# Altium schematic sheet ZigBee.SchDoc
size A3
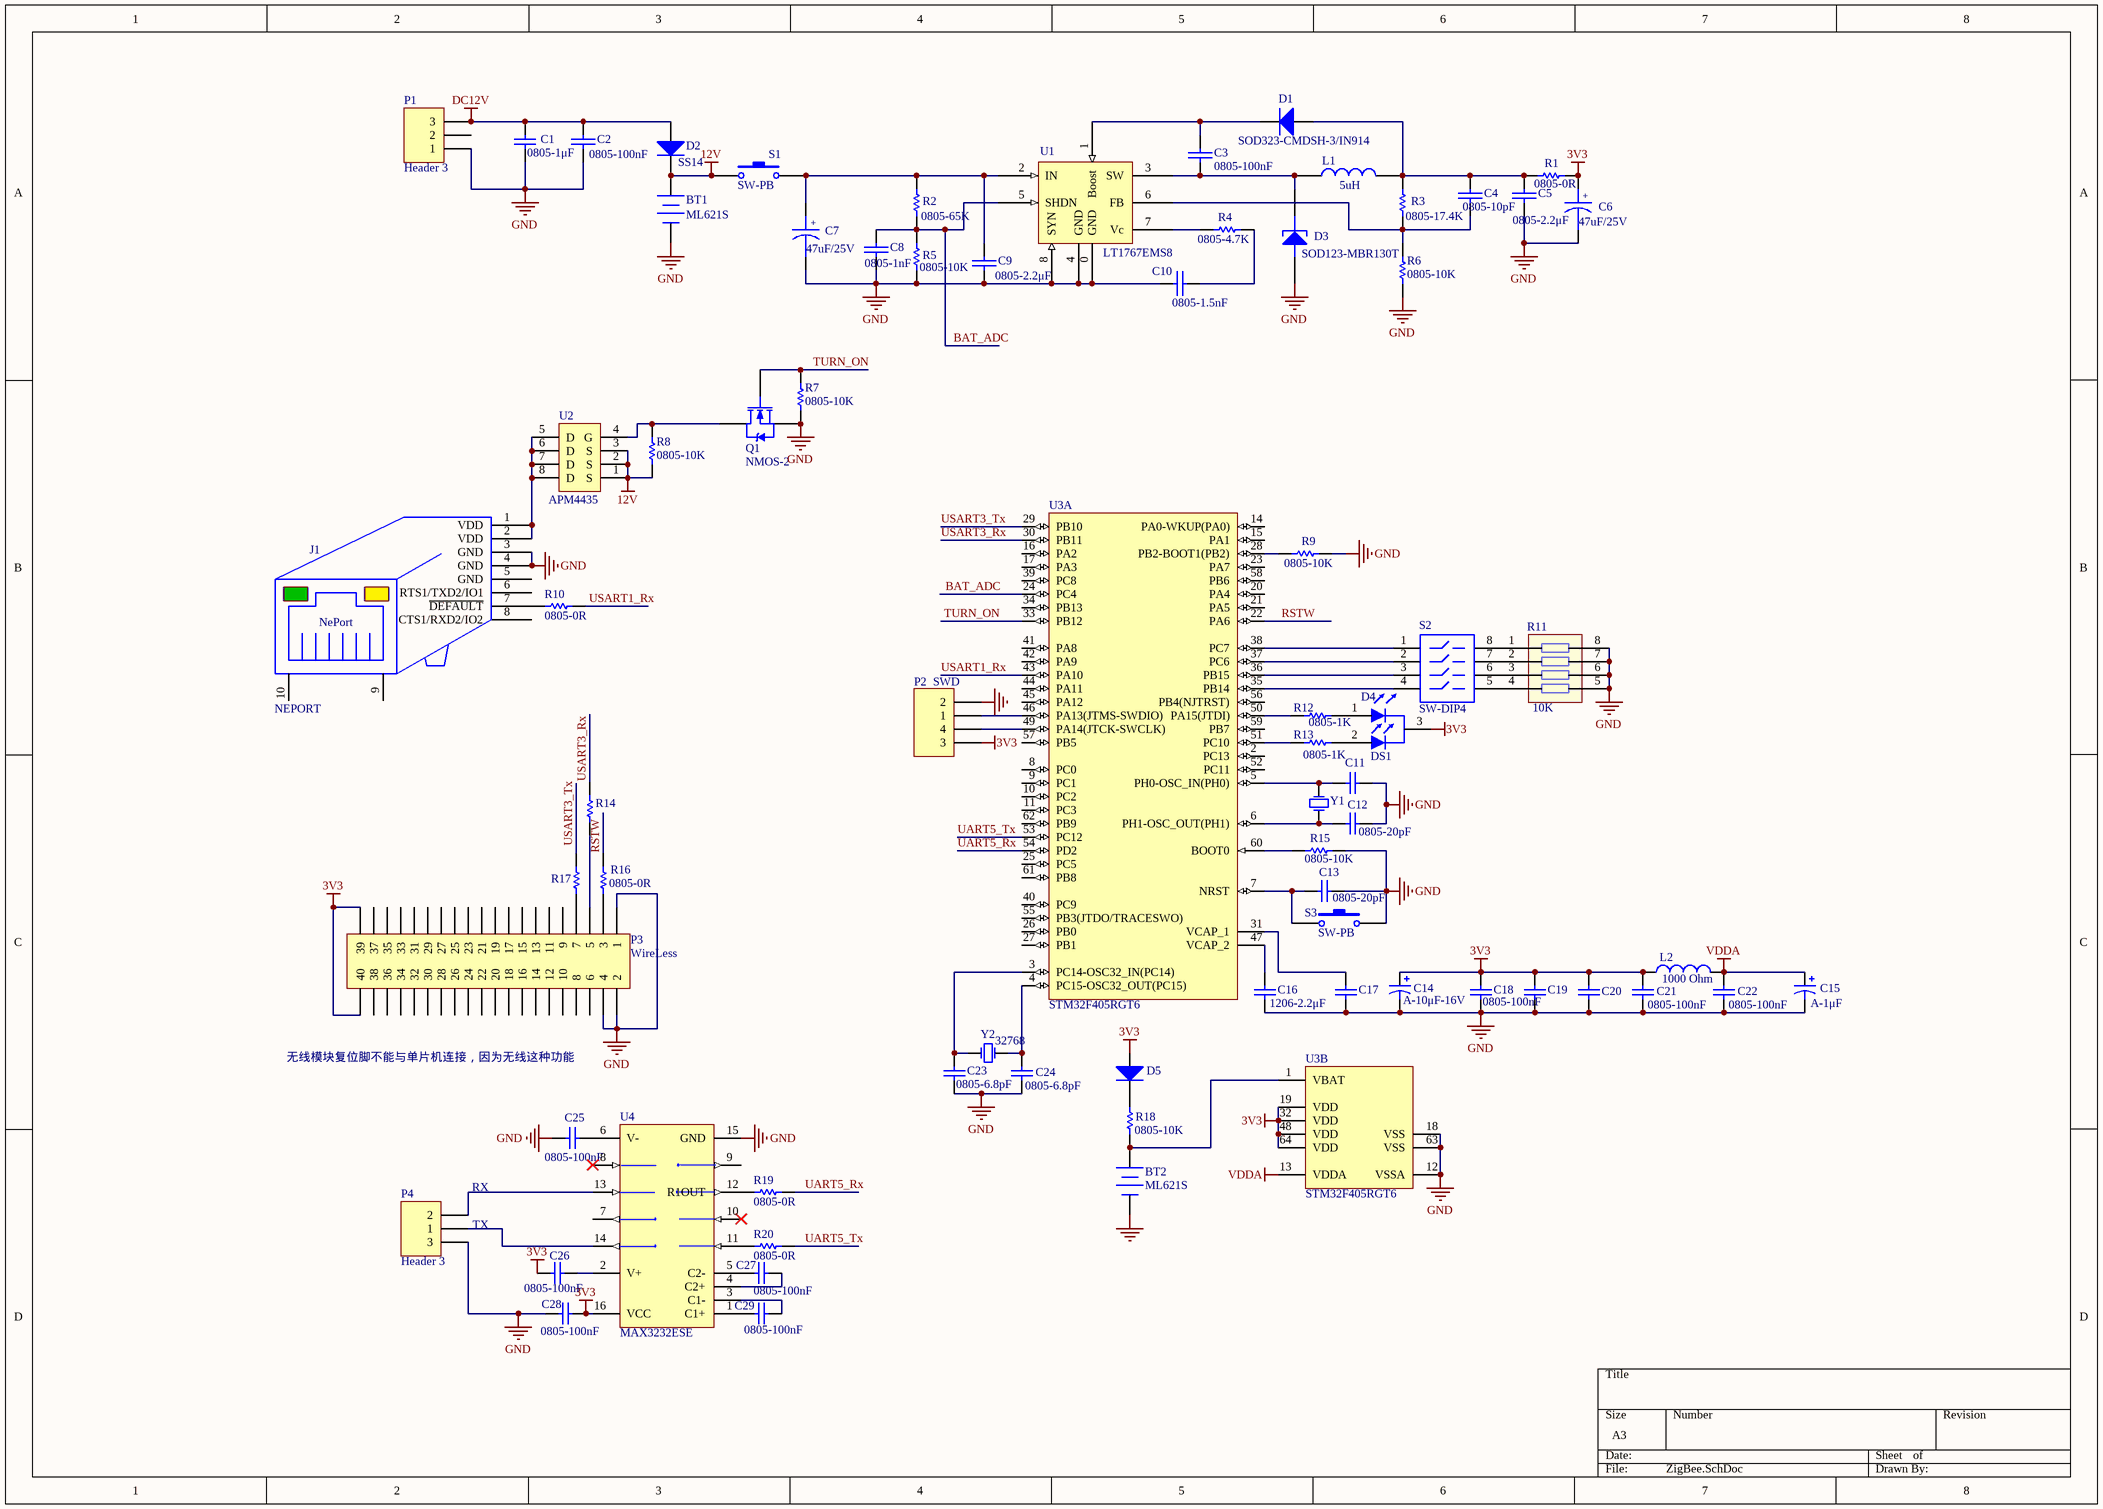
[diagram p0: ZigBee.SchDoc]

## Parts
BT1  ML621S  [VH-3.96-2]
BT2  ML621S  [ML621]
C1  0805-1μF  [0805C]
C2  0805-100nF  [0805C]
C3  0805-100nF  [0805C]
C4  0805-10pF  [0805C]
C5  0805-2.2μF  [0805C]
C6  47uF/25V  [SMD-47uF/25V]
C7  47uF/25V  [SMD-47uF/25V]
C8  0805-1nF  [0805C]
C9  0805-2.2μF  [0805C]
C10  0805-1.5nF  [0805C]
C11  0805-20pF  [0805C]  (value not drawn)
C12  0805-20pF  [0805C]
C13  0805-20pF  [0805C]
C14  A-10μF-16V  [TANA]
C15  A-1μF  [TANA]
C16  1206-2.2μF  [1206C]
C17  1206-2.2μF  [1206C]  (value not drawn)
C18  0805-100nF  [0805C]
C19  0805-100nF  [0805C]  (value not drawn)
C20  0805-100nF  [0805C]  (value not drawn)
C21  0805-100nF  [0805C]
C22  0805-100nF  [0805C]
C23  0805-6.8pF  [0805C]
C24  0805-6.8pF  [0805C]
C25  0805-100nF  [0805C]
C26  0805-100nF  [0805C]
C27  0805-100nF  [0805C]
C28  0805-100nF  [0805C]
C29  0805-100nF  [0805C]
D1  SOD323-CMDSH-3/IN914  [SOD-323]
D2  SS14  [DO-214AC]
D3  SOD123-MBR130T  [SOD123/X.85]
D4  DS1  [5MM/F5]
D5  1N4148  [SOD-80/MLL34]  (value not drawn)
J1  NEPORT  [RJ45_8P8C]
L1  5uH  [SMD]
L2  1000 Ohm  [INDC4516AM]
P1  Header 3  [XH-2.54-3]
P2  SWD  [HDR1X4]
P3  WireLess  [SMALL/MIDDLE OEM MODEM]
P4  Header 3  [XH-2.54-3]
Q1  NMOS-2  [TO-220AB]
R1  0805-0R  [0805]
R2  0805-65K  [0805]
R3  0805-17.4K  [0805]
R4  0805-4.7K  [0805]
R5  0805-10K  [0805]
R6  0805-10K  [0805]
R7  0805-10K  [0805]
R8  0805-10K  [0805]
R9  0805-10K  [0805]
R10  0805-0R  [0805]
R11  10K  [8P4R-0603]
R12  0805-1K  [0805]
R13  0805-1K  [0805]
R14  0805-0R  [0805]  (value not drawn)
R15  0805-10K  [0805]
R16  0805-0R  [0805]
R17  0805-0R  [0805]  (value not drawn)
R18  0805-10K  [0805]
R19  0805-0R  [0805]
R20  0805-0R  [0805]
S1  SW-PB  [XH-2.54-2]
S2  SW-DIP4  [DIP-8]
S3  SW-PB  [SW3*4*2MM]
U1  LT1767EMS8  [MS8_N]
U2  APM4435  [SOP-8M]
U3  STM32F405RGT6  [TQFP64_M]  (parts A,B of 2)
U4  MAX3232ESE  [NSO16_N]
Y1  8MHz  [XTAL]  (value not drawn)
Y2  32768  [1206CY]

## Nets
3V3: C6.1 C14.1 C18.2 C19.2 C20.2 C21.2 C26.2 C28.1 D4.3 D5.1(A) L2.1 P2.3 P3.39 P3.40 R1.2 U3.19(VDD) U3.32(VDD) U3.48(VDD) U3.64(VDD) U4.16(VCC)
12V: BT1.2(+) D2.2(K) R8.1 S1.2 U2.1(S) U2.2(S) U2.3(S)
DC12V: C1.1 C2.1 D2.1(A) P1.3
GND: BT1.1(-) BT2.1(-) C1.2 C2.2 C5.2 C6.2 C7.2 C8.2 C9.2 C10.1 C11.1 C12.1 C13.1 C14.2 C15.2 C16.1 C17.1 C18.1 C19.1 C20.1 C21.1 C22.1 C23.2 C24.2 C25.2 C28.2 D3.1(A) J1.3(GND) J1.4(GND) P1.1 P2.2 P3.1 P3.2 P3.4 P4.3 Q1.3(D) R5.1 R6.1 R7.1 R9.2 R11.5 R11.6 R11.7 R11.8 R15.2 S3.2 U1.0(GND) U1.4(GND) U1.8(SYN) U3.12(VSSA) U3.18(VSS) U3.63(VSS) U4.15(GND)
VDDA: C15.1 C22.2 L2.2 U3.13(VDDA)
BAT_ADC: C8.1 R2.1 R5.2 U1.5(SHDN) U3.24(PC4)
RSTW: R16.1 U3.22(PA6)
TURN_ON: Q1.1(G) R7.2 U3.33(PB12)
UART5_Rx: R19.2 U3.54(PD2)
UART5_Tx: R20.2 U3.53(PC12)
USART1_Rx: R10.1 U3.43(PA10)
USART3_Rx: R14.1 U3.30(PB11)
USART3_Tx: R17.1 U3.29(PB10)
NetBT2_2: BT2.2(+) R18.2 U3.1(VBAT)
NetC3_1: C3.1 D1.2(K) U1.1(Boost)
NetC3_2: C3.2 D3.2(K) L1.1 U1.3(SW)
NetC4_1: C4.1 C5.1 D1.1(A) L1.2 R1.1 R3.2
NetC4_2: C4.2 R3.1 R6.2 U1.6(FB)
NetC7_1: C7.1 C9.1 R2.2 S1.1 U1.2(IN)
NetC10_2: C10.2 R4.1
NetC11_2: C11.2 U3.5(PH0-OSC_IN(PH0)) Y1.2(OSC2)
NetC12_2: C12.2 U3.6(PH1-OSC_OUT(PH1)) Y1.1(OSC1)
NetC13_2: C13.2 S3.1 U3.7(NRST)
NetC16_2: C16.2 U3.47(VCAP_2)
NetC17_2: C17.2 U3.31(VCAP_1)
NetC23_1: C23.1 U3.3(PC14-OSC32_IN(PC14)) Y2.2(OSC2)
NetC24_1: C24.1 U3.4(PC15-OSC32_OUT(PC15)) Y2.1(OSC1)
NetC25_1: C25.1 U4.6(V-)
NetC26_1: C26.1 U4.2(V+)
NetC27_1: C27.1 U4.4(C2+)
NetC27_2: C27.2 U4.5(C2-)
NetC29_1: C29.1 U4.3(C1-)
NetC29_2: C29.2 U4.1(C1+)
NetD4_1: D4.1 R12.2
NetD4_2: D4.2 R13.2
NetD5_2: D5.2(K) R18.1
NetJ1_1: J1.1(VDD) J1.2(VDD) U2.5(D) U2.6(D) U2.7(D) U2.8(D)
NetJ1_7: J1.7(~{DEFAULT}) R10.2
NetP2_1: P2.1 U3.46(PA13(JTMS-SWDIO))
NetP2_4: P2.4 U3.49(PA14(JTCK-SWCLK))
NetP3_3: P3.3 R16.2
NetP3_5: P3.5 R14.2
NetP3_7: P3.7 R17.2
NetP4_1: P4.1 U4.14(T1OUT)
NetP4_2: P4.2 U4.13(R1IN)
NetQ1_2: Q1.2(S) R8.2 U2.4(G)
NetR4_2: R4.2 U1.7(Vc)
NetR9_1: R9.1 U3.28(PB2-BOOT1(PB2))
NetR11_1: R11.1 S2.8
NetR11_2: R11.2 S2.7
NetR11_3: R11.3 S2.6
NetR11_4: R11.4 S2.5
NetR12_1: R12.1 U3.50(PA15(JTDI))
NetR13_1: R13.1 U3.51(PC10)
NetR15_1: R15.1 U3.60(BOOT0)
NetR19_1: R19.1 U4.12(R1OUT)
NetR20_1: R20.1 U4.11(T1IN)
NetS2_1: S2.1 U3.38(PC7)
NetS2_2: S2.2 U3.37(PC6)
NetS2_3: S2.3 U3.36(PB15)
NetS2_4: S2.4 U3.35(PB14)

Not connected (* = marked no-connect by the designer): J1 5(GND) 6(RTS1/TXD2/IO1) 8(CTS1/RXD2/IO2) 9(SHELL) 10(SHELL); P1 2; P3 6 8 9 10 11 12 13 14 15 16 17 18 19 20 21 22 23 24 25 26 27 28 29 30 31 32 33 34 35 36 37 38; U3 2(PC13) 8(PC0) 9(PC1) 10(PC2) 11(PC3) 14(PA0-WKUP(PA0)) 15(PA1) 16(PA2) 17(PA3) 20(PA4) 21(PA5) 23(PA7) 25(PC5) 26(PB0) 27(PB1) 34(PB13) 39(PC8) 40(PC9) 41(PA8) 42(PA9) 44(PA11) 45(PA12) 52(PC11) 55(PB3(JTDO/TRACESWO)) 56(PB4(NJTRST)) 57(PB5) 58(PB6) 59(PB7) 61(PB8) 62(PB9); U4 7(T2OUT) 8(R2IN)* 9(R2OUT) 10(T2IN)*

## Notes on the sheet
- 无线模块复位脚不能与单片机连接，因为无线这种功能
- (near P4) RX
- (near P4) TX
- (in symbol NEPORT) NePort
- (in symbol 电解电容) +

## Library data of the parts
BT1 BT2 = Battery: Multicell Battery; Published: 24-Mar-1999; LatestRevisionDate: 17-Jul-2002; LatestRevisionNote: Re-released for DXP Platform.; PackageReference: BAT-2; Publisher: Altium Limited
C1 C11-C13 C16-C29 = Cap: Capacitor; Published: 8-Jun-2000; LatestRevisionDate: 17-Jul-2002; LatestRevisionNote: Re-released for DXP Platform.; PackageReference: RAD-0.3; Publisher: Altium Limited; PackageDescription: Radial Cap, Thru-Hole; 2 Leads; 0.3 in Pin Spacing
  C1: Value: 0805-1μF
  C11-C13: Value: 0805-20pF
  C16 C17: Value: 1206-2.2μF
  C18-C22 C25-C29: Value: 0805-100nF
  C23 C24: Value: 0805-6.8pF
C2-C5 C8-C10 = 普通电容: Capacitor
C6 C7 = 电解电容: Capacitor
C14 = Cap Pol1: Polarized Capacitor (Radial); Published: 8-Jun-2000; LatestRevisionDate: 17-Jul-2002; LatestRevisionNote: Re-released for DXP Platform.; PackageReference: RB7.6-15; Publisher: Altium Limited; PackageDescription: Polarized Capacitor (Radial); 2 Leads; Value: A-10μF-16V
C15 = Cap Pol1: Polarized Capacitor (Radial); Value: 1μF; Published: 8-Jun-2000; LatestRevisionDate: 17-Jul-2002; LatestRevisionNote: Re-released for DXP Platform.; PackageReference: RB7.6-15; Publisher: Altium Limited; PackageDescription: Polarized Capacitor (Radial); 2 Leads
D1 D2 = DIODE
D3 = TUNNEL: Tunnel FDiode
D5 = Diode 1N4148: High Conductance Fast Diode; Published: 8-Jun-2000; LatestRevisionDate: 17-Jul-2002; LatestRevisionNote: Re-released for DXP Platform.; DatasheetVersion: 1997; PackageReference: DO-35; Publisher: Altium Limited; PackageDescription: Diode, Axial; Body 3.8 x 1.9 mm (LxDia. max), Lead Dia. 0.53 mm (max); Code_JEDEC: DO-204-AH; ComponentLink1Description: Manufacturer Link; ComponentLink1URL: http://www.fairchildsemi.com/; ComponentLink2Description: Datasheet; ComponentLink2URL: http://www.fairchildsemi.com/ds/1N%2F1N4148.pdf
J1 = NEPORT: serial to ethernet RJ45 jack
L1 = INDUCTOR
L2 = Inductor: BLM41PG102SN1L\CBW451616U900; Code_IEC: 1005; Published: 8-Jun-2000; LatestRevisionDate: 29-May-2009; LatestRevisionNote: IPC-7351 Footprint Added.; PackageReference: 0402-A; Publisher: Altium Limited; PackageDescription: Chip Inductor; Code_JEITA: 0402; Value: 1000 Ohm
P1 P4 = Header 3: Header, 3-Pin; LatestRevisionDate: 17-Jul-2002; LatestRevisionNote: Re-released for DXP Platform.; Publisher: Altium Limited
P2 = Header 4: Header, 4-Pin; LatestRevisionDate: 17-Jul-2002; LatestRevisionNote: Re-released for DXP Platform.; Publisher: Altium Limited
P3 = Header 20X2: Header, 20-Pin, Dual row; LatestRevisionDate: 17-Jul-2002; LatestRevisionNote: Re-released for DXP Platform.; Publisher: Altium Limited
Q1 = NMOS-2: N-Channel Power MOSFET; Note: Pin 2 is electrically connected to pin 4.; Published: 8-Jun-2000; LatestRevisionDate: 17-Jul-2002; LatestRevisionNote: Re-released for DXP Platform.; DatasheetDocument: PD-9.814; PackageReference: TO-220AB; Publisher: Altium Limited; Code_JEDEC: TO-220-AB; ComponentLink1Description: Manufacturer Link; ComponentLink1URL: http://www.irf.com/
R1-R9 R15 R18 = Res1: Resistor; Published: 8-Jun-2000; LatestRevisionDate: 17-Jul-2002; LatestRevisionNote: Re-released for DXP Platform.; PackageReference: AXIAL-0.3; Publisher: Altium Limited; PackageDescription: Axial Device, Thru-Hole; 2 Leads; 0.3 in Pin Spacing
  R1: Value: 0805-0R
  R2: Value: 0805-65K
  R3: Value: 0805-17.4K
  R4: Value: 0805-4.7K
  R5-R9 R15 R18: Value: 0805-10K
R10 R14 R16 R17 R19 R20 = Res1: Resistor; Rule: PcbType=ProtelPcb; Published: 8-Jun-2000; LatestRevisionDate: 17-Jul-2002; LatestRevisionNote: Re-released for DXP Platform.; PackageReference: AXIAL-0.3; Publisher: Altium Limited; PackageDescription: Axial Device, Thru-Hole; 2 Leads; 0.3 in Pin Spacing; Value: 0805-0R
R11 = RN4
R12 R13 = Res Semi: Semiconductor Resistor; Published: 8-Jun-2000; LatestRevisionDate: 17-Jul-2002; LatestRevisionNote: Re-released for DXP Platform.; PackageReference: AXIAL-0.5; Publisher: Altium Limited; Value: 0805-1K
S1 S3 = SW-PB: Switch; Published: 24-Mar-1999; LatestRevisionDate: 17-Jul-2002; LatestRevisionNote: Re-released for DXP Platform.; PackageReference: SPST-2; Publisher: Altium Limited
S2 = SW-DIP4: DIP Switch; Published: 24-Mar-1999; LatestRevisionDate: 17-Jul-2002; LatestRevisionNote: Re-released for DXP Platform.; PackageReference: DIP-8; Publisher: Altium Limited
U3 = STM32F405RGT6: ARM Cortex-M4 32-bit MCU+FPU, 210 DMIPS, 1024 kB Flash, 192 kB Internal RAM, 51 I/Os, 64-pin LQFP, -40 to 85 degC, Tray; Manufacturer: STMicroelectronics; D/A Converter: 2x12-bit; FLASH Size (Prog) (kB): 1024; I/Os (High Current): 51; Internal RAM Size (kB): 192; Operating Frequency(F) (Processor speed) (MHz): 168; Supply Voltage(Vcc) max (V): 3.6; Supply Voltage(Vcc) min (V): 1.8; DatasheetVersion: Rev. 4; PackageVersion: Rev. 4, 06/2013; PackageReference: LQFP64; PackageDescription: 64-Pin Low Profile Quad Flat Package, 10 x 10 mm Body, 0.5 mm Pitch; Supplier 1: Digi-Key; Supplier Part Number 1: 497-11767-ND; Supplier 2: Farnell; Supplier Part Number 2: 2064363; Supplier 3: Newark; Supplier Part Number 3: 73T2329; Supplier 4: Mouser; Supplier Part Number 4: 511-STM32F405RGT6; Core: ARM Cortex-M4; Packing: Tray; Mounting Technology: Surface Mount; PartNumber: STM32F405RGT6; ComponentLink1Description: Manufacturer URL; ComponentLink1URL: http://www.st.com/web/en/home.html; ComponentLink2Description: Datasheet; ComponentLink2URL: http://www.st.com/st-web-ui/static/active/en/resource/technical/document/datasheet/DM00037051.pdf; ComponentLink3Description: Package Specification; ComponentLink3URL: http://www.st.com/st-web-ui/static/active/en/resource/technical/document/datasheet/DM00037051.pdf
U4 = MAX3232ESE: 3.0V TO 5.5V, Low-Power, up to 1Mbps, True RS-232 Transceiver Using Four 0.1µF External Capacitor; Published: 16-Jan-2001; LatestRevisionDate: 13-Apr-2006; LatestRevisionNote: IPC-7351 Footprint Added.; DatasheetVersion: Mar-1999; PackageReference: NSO16; Publisher: Altium Limited; PackageDescription: 16-Pin Small Outline Integrated Circuit 1.27 mm Pitch; Code_JEDEC: MS-012-AC; Code_IPC: SOIC127P600-16; ComponentLink1Description: Manufacturer Link; ComponentLink1URL: http://www.maxim-ic.com/; ComponentLink2Description: Datasheet; ComponentLink2URL: http://pdfserv.maxim-ic.com/en/ds/MAX3222-MAX3241.pdf
Y1 Y2 = XTAL: Crystal Oscillator; Published: 8-Jun-2000; LatestRevisionDate: 17-Jul-2002; LatestRevisionNote: Re-released for DXP Platform.; PackageReference: R38; Publisher: Altium Limited; PackageDescription: Crystal, Thru-Hole; 2 Leads; Body 3.1 x 8.2 mm (Dia.xH)